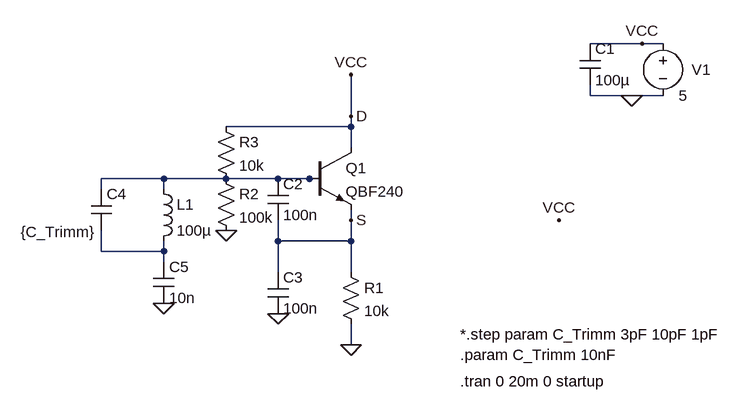
[diagram p0: schematic BF241-Colpitz.asc]
BF241-Colpitz.asc, the LTspice schematic file:
Version 4
SHEET 1 880 680
WIRE 224 -240 144 -240
WIRE 256 -240 224 -240
WIRE 144 -160 144 -176
WIRE 208 -160 144 -160
WIRE 256 -160 208 -160
WIRE -224 -128 -224 -192
WIRE -224 -112 -224 -128
WIRE -224 -112 -416 -112
WIRE -224 -80 -224 -112
WIRE -512 -32 -608 -32
WIRE -416 -32 -512 -32
WIRE -336 -32 -416 -32
WIRE -288 -32 -336 -32
WIRE -272 -32 -288 -32
WIRE -608 -16 -608 -32
WIRE -512 -16 -512 -32
WIRE -224 32 -224 16
WIRE -336 64 -336 32
WIRE -224 64 -224 32
WIRE -224 64 -336 64
WIRE -608 80 -608 48
WIRE -512 80 -512 64
WIRE -512 80 -608 80
WIRE -512 96 -512 80
WIRE -336 112 -336 64
WIRE -224 112 -224 64
WIRE -224 224 -224 192
FLAG 96 32 VCC
FLAG 208 -160 0
FLAG 224 -240 VCC
FLAG -224 32 S
FLAG -224 -128 D
FLAG -224 224 0
FLAG -224 -192 VCC
FLAG -336 176 0
FLAG -416 48 0
FLAG -512 160 0
SYMBOL voltage 256 -256 R0
WINDOW 123 0 0 Left 0
WINDOW 39 0 0 Left 0
WINDOW 0 44 56 Left 0
SYMATTR InstName V1
SYMATTR Value 5
SYMBOL res -240 96 R0
SYMATTR InstName R1
SYMATTR Value 10k
SYMBOL cap 128 -240 R0
SYMATTR InstName C1
SYMATTR Value 100µ
SYMBOL cap -352 -32 R0
SYMATTR InstName C2
SYMATTR Value 100n
SYMBOL cap -352 112 R0
SYMATTR InstName C3
SYMATTR Value 100n
SYMBOL ind -528 -32 R0
SYMATTR InstName L1
SYMATTR Value 100µ
SYMBOL res -432 -128 R0
SYMATTR InstName R3
SYMATTR Value 10k
SYMBOL cap -624 -16 R0
WINDOW 3 -108 66 Left 0
SYMATTR Value {C_Trimm}
SYMATTR InstName C4
SYMBOL npn -288 -80 R0
SYMATTR InstName Q1
SYMATTR Value QBF240
SYMBOL cap -528 96 R0
SYMATTR InstName C5
SYMATTR Value 10n
SYMBOL res -432 -48 R0
SYMATTR InstName R2
SYMATTR Value 100k
TEXT -56 280 Left 0 !.tran 0 20m 0 startup
TEXT -56 208 Left 0 !*.step param C_Trimm 3pF 10pF 1pF\n.param C_Trimm 10nF

The netlist it stands for:
* BF241-Colpitz.asc
V1 D 0 5
R1 S 0 10k
C1 D 0 100µ
C2 N001 S 100n
C3 S 0 100n
L1 N001 N002 100µ
R3 D N001 10k
C4 N001 N002 {C_Trimm}
Q1 D N001 S 0 QBF240
C5 N002 0 10n
R2 N001 0 100k
.model NPN NPN
.model PNP PNP
.lib standard.bjt
.tran 0 20m 0 startup
*.step param C_Trimm 3pF 10pF 1pF
.param C_Trimm 10nF
.backanno
.end